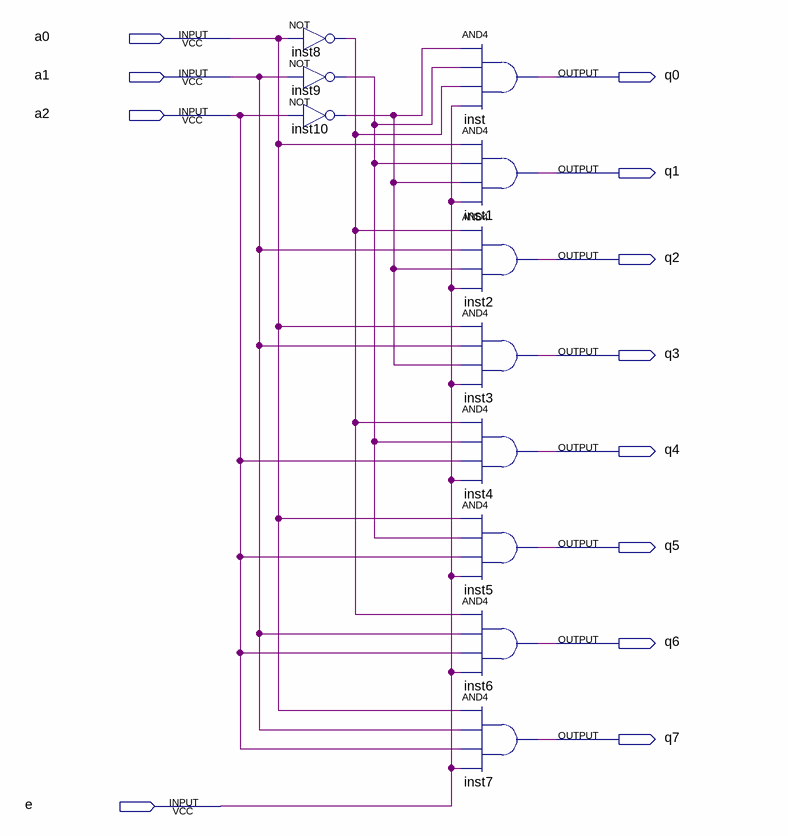
[diagram p0: schematic sheet]
// Quartus schematic point1.bdf as structural Verilog: 11 symbols, 12 pins
module point1 (
  input  a0,
  input  a1,
  input  a2,
  input  e,
  output q0,
  output q1,
  output q2,
  output q3,
  output q4,
  output q5,
  output q6,
  output q7
);

  wire inst8_out, inst9_out, inst10_out;

  not inst8 (inst8_out, a0);
  not inst9 (inst9_out, a1);
  not inst10 (inst10_out, a2);
  and inst (q0, inst10_out, inst9_out, inst8_out, e);
  and inst1 (q1, a0, inst9_out, inst10_out, e);
  and inst2 (q2, inst8_out, a1, inst10_out, e);
  and inst3 (q3, a0, a1, inst10_out, e);
  and inst4 (q4, inst8_out, inst9_out, a2, e);
  and inst5 (q5, a0, inst9_out, a2, e);
  and inst6 (q6, inst8_out, a1, a2, e);
  and inst7 (q7, a0, a1, a2, e);
endmodule
